# EAGLE schematic OutputControls_v5 (EAGLE 9.7.0)
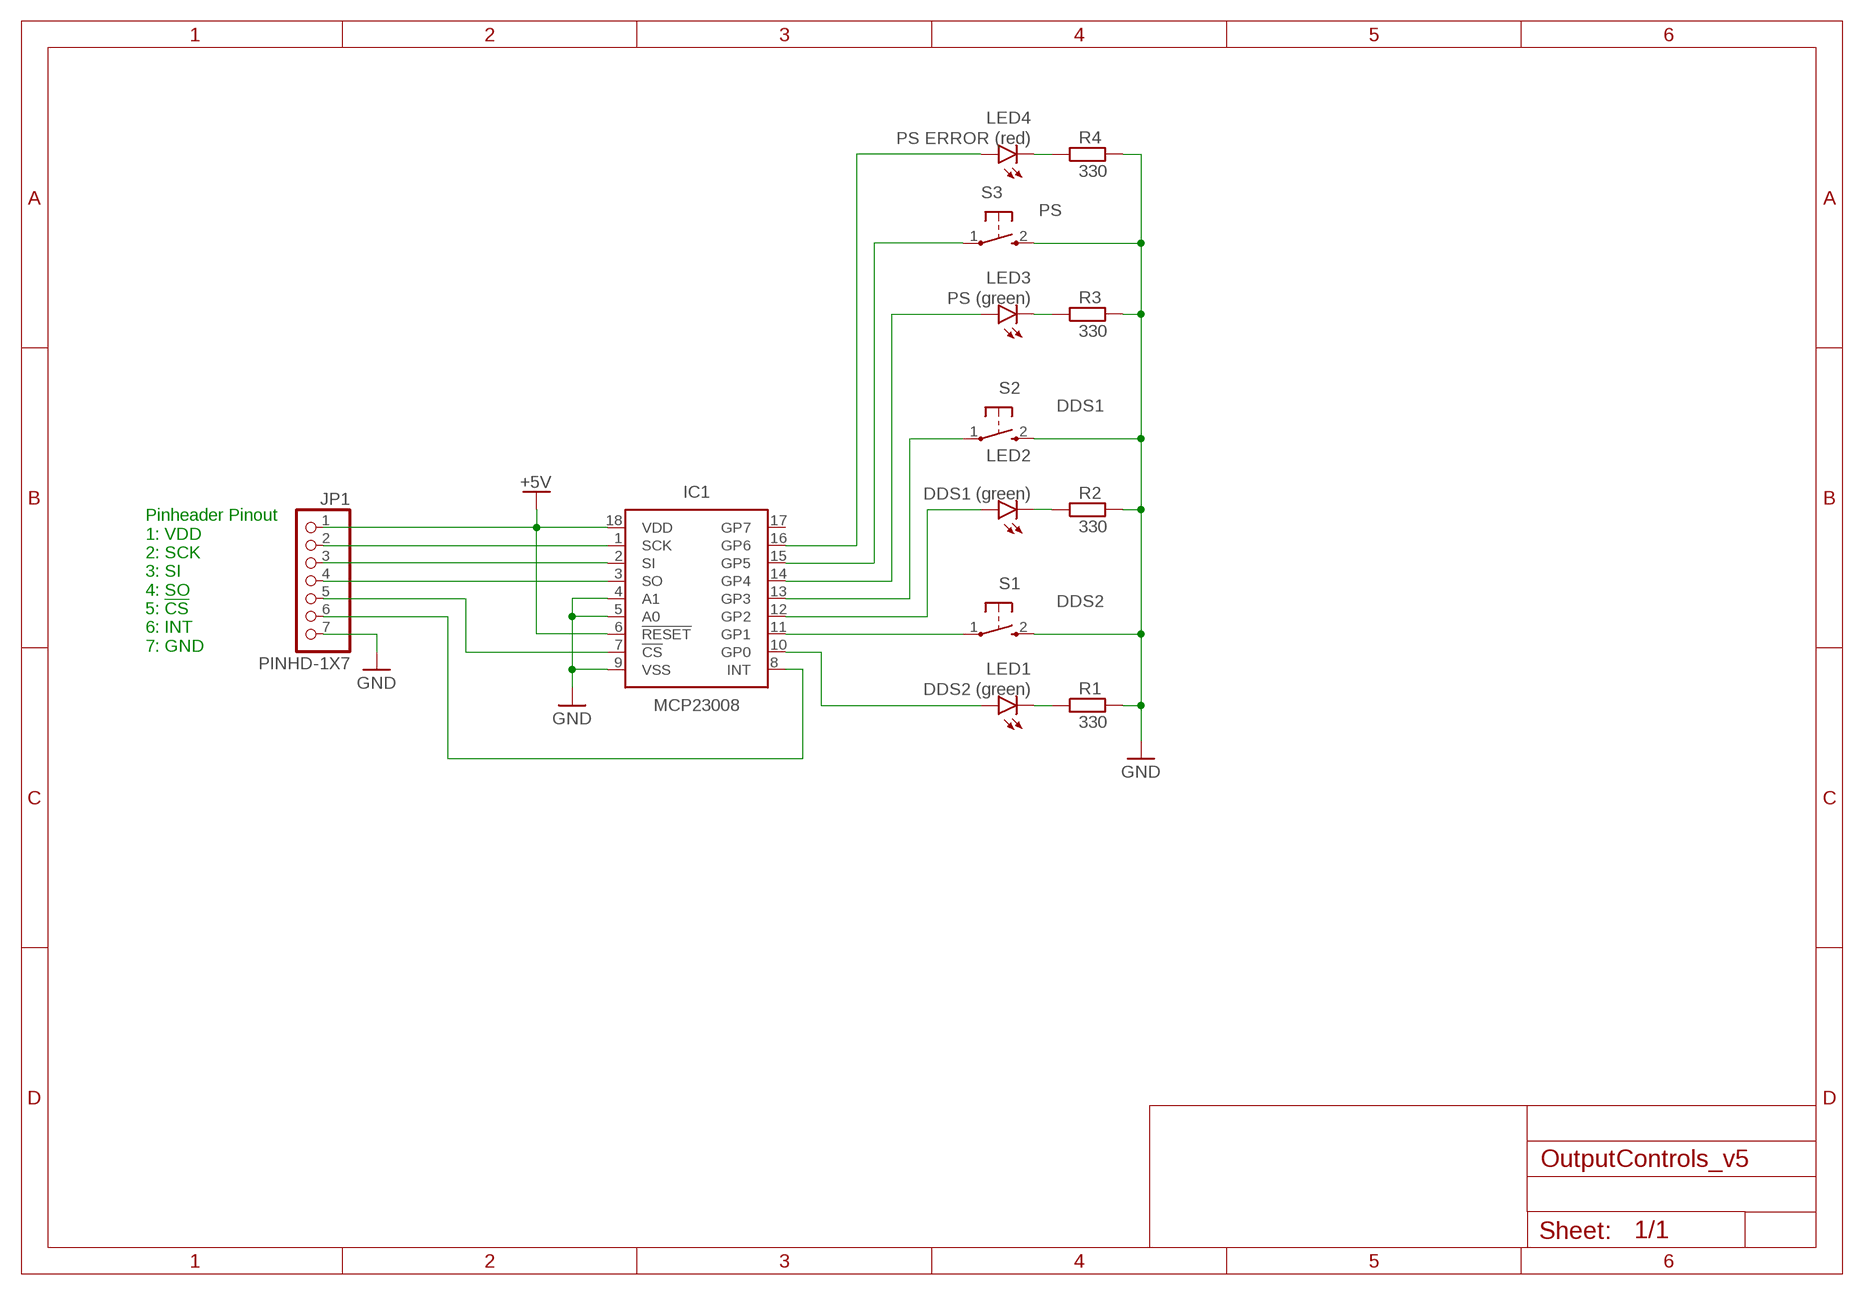
[diagram p0: schematic, sheet 1]

## Parts
IC1  MCP23008  MCP23S08-E/SO-SOIC  [SOIC127P1030X265-18N]
JP1  PINHD-1X7  [1X07]
LED1  DDS2 (green)  LEDCHIPLED_0603  [CHIPLED_0603]
LED2  DDS1 (green)  LEDCHIPLED_0603  [CHIPLED_0603]
LED3  PS (green)  LEDCHIPLED_0603  [CHIPLED_0603]
LED4  PS ERROR (red)  LEDCHIPLED_0603  [CHIPLED_0603]
R1  330  R-EU_R0805  [R0805]
R2  330  R-EU_R0805  [R0805]
R3  330  R-EU_R0805  [R0805]
R4  330  R-EU_R0805  [R0805]
S1  DDS2  KURZHUBTASTER  [B3F-10XX]
S2  DDS1  KURZHUBTASTER  [B3F-10XX]
S3  PS  KURZHUBTASTER  [B3F-10XX]

## Nets
+5V: IC1.6(!RESET) IC1.18(VDD) JP1.1
GND: IC1.4(A1) IC1.5(A0) IC1.9(VSS) JP1.7 R1.2 R2.2 R3.2 R4.2 S1.2(S) S2.2(S) S3.2(S)
N$1: IC1.10(GP0) LED1.A
N$2: IC1.11(GP1) S1.1(P)
N$3: IC1.12(GP2) LED2.A
N$4: LED1.C R1.1
N$5: LED2.C R2.1
N$6: LED3.C R3.1
N$7: IC1.13(GP3) S2.1(P)
N$8: IC1.14(GP4) LED3.A
N$9: IC1.15(GP5) S3.1(P)
N$10: LED4.C R4.1
N$11: IC1.1(SCK) JP1.2
N$12: IC1.2(SI) JP1.3
N$13: IC1.3(SO) JP1.4
N$14: IC1.7(!CS) JP1.5
N$15: IC1.8(INT) JP1.6
N$17: IC1.16(GP6) LED4.A
Unconnected: IC1.17(GP7)

## Notes on the sheet
- Pinheader Pinout
  1: VDD
  2: SCK
  3: SI
  4: SO
  5: !CS
  6: INT
  7: GND

## Library data of the parts
IC1 = OwnDevices:MCP23S08*: 8-Bit I/O Expander with Serial Interface Datasheet <https://ww1.microchip.com/downloads/en/DeviceDoc/21919e.pdf>; CATEGORY: IC_Interface; DESCRIPTION: 8-Bit I/O Expander with Serial Interface; MANUFACTURER: Microchip Technology; MPN: MCP23008-E/SO; OPERATING_TEMP: -40°C to 125°C; PART_STATUS: Active; ROHS_COMPLIANT: COMPLIANT; SUB-CATEGORY: I/O Expander; TYPE: 8 bit
JP1 = Connector:PINHD-1X7: PIN HEADER; CATEGORY: Headers; DESCRIPTION: Header, Straight, 7 Position; MANUFACTURER: Generic; MPN: Generic; OPERATING_TEMPERATURE: Generic; PART_STATUS: Active; PITCH: 0.100" (2.54mm); ROHS_COMPLIANCE: Generic; SERIES: Generic; SUB-CATEGORY: Headers, Male Pins; TYPE: Board to Board or Cable, Unshrouded, Through Hole, Straight
LED1-LED4 = OwnDevices:LED: LED OSRAM: - CHIPLED LG R971, LG N971, LY N971, LG Q971, LY Q971, LO R971, LY R971 LH N974, LH R974 LS Q976, LO Q976, LY Q976 LO Q996 - Hyper CHIPLED LW Q18S LB Q993, LB Q99A, LB R99A - SideLED LS A670, LO A670, LY A670, LG A670, LP A670 LB A673, LV A673, LT A673, LW A673 LH A674 LY A675 LS A676, LA A676, LO A676, LY A676, LW A676 LS A679, LY A679, LG A679 - Hyper Micro SIDELED® LS Y876, LA Y876, LO Y876, LY Y876 LT Y87S - SmartLED LW L88C, LW L88S LB L89C, LB L89S, LG L890 LS L89K, LO L89K, LY L89K LS L896, LA L896, LO L896, LY L896 - TOPLED LS T670, LO T670, LY T670, LG T670, LP T670 LSG T670, LSP T670, LSY T670, LOP T670, LYG T670 LG T671, LOG T671, LSG T671 LB T673, LV T673, LT T673, LW T673 LH T674 LS T676, LA T676, LO T676, LY T676, LB T676, LH T676, LSB T676, LW T676 LB T67C, LV T67C, LT T67C, LS T67K, LO T67K, LY T67K, LW E67C LS E67B, LA E67B, LO E67B, LY E67B, LB E67C, LV E67C, LT E67C LW T67C LS T679, LY T679, LG T679 LS T770, LO T770, LY T770, LG T770, LP T770 LB T773, LV T773, LT T773, LW T773 LH T774 LS E675, LA E675, LY E675, LS T675 LS T776, LA T776, LO T776, LY T776, LB T776 LHGB T686 LT T68C, LB T68C - Hyper Mini TOPLED® LB M676 - Mini TOPLED Santana® LG M470 LS M47K, LO M47K, LY M47K Source: http://www.osram.convergy.de LUXEON: - LUMILED® LXK2-PW12-R00, LXK2-PW12-S00, LXK2-PW14-U00, LXK2-PW14-V00 LXK2-PM12-R00, LXK2-PM12-S00, LXK2-PM14-U00 LXK2-PE12-Q00, LXK2-PE12-R00, LXK2-PE12-S00, LXK2-PE14-T00, LXK2-PE14-U00 LXK2-PB12-K00, LXK2-PB12-L00, LXK2-PB12-M00, LXK2-PB14-N00, LXK2-PB14-P00, LXK2-PB14-Q00 LXK2-PR12-L00, LXK2-PR12-M00, LXK2-PR14-Q00, LXK2-PR14-R00 LXK2-PD12-Q00, LXK2-PD12-R00, LXK2-PD12-S00 LXK2-PH12-R00, LXK2-PH12-S00 LXK2-PL12-P00, LXK2-PL12-Q00, LXK2-PL12-R00 Source: www.luxeon.com KINGBRIGHT: KA-3528ASYC Source: www.kingbright.com
R1-R4 = OwnDevices:R-EU_: RESISTOR, European symbol; SPICEPREFIX: R
S1-S3 = OwnDevices:KURZHUBTASTER: OMRON SWITCH